# EAGLE design Encoder Adapter (EAGLE 9.6.1)
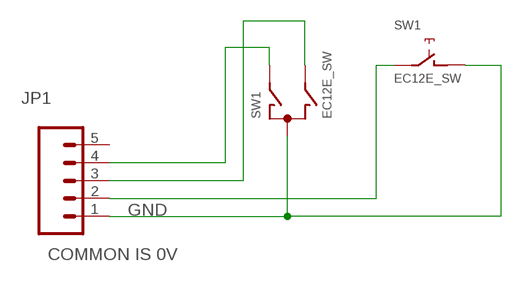
[diagram p0: schematic, sheet 1]

## Parts
JP1  M05LOCK  [1X05_LOCK]
SW1  EC12E_SW  [ALPS_EC12E_SW]

## Nets
GND: JP1.1 SW1.C SW1.D
N$3: JP1.2 SW1.E
N$4: JP1.4 SW1.A
N$5: JP1.3 SW1.B
Unconnected: JP1.5 SW1.GND1(G) SW1.GND2(G)

## Notes on the sheet
- COMMON IS 0V

## Library data of the parts
JP1 = SparkFun-Connectors:M05: Header 5 Standard 5-pin 0.1" header. Use with straight break away headers (SKU : PRT-00116), right angle break away headers (PRT-00553), swiss pins (PRT-00743), machine pins (PRT-00117), and female headers (PRT-00115). Molex polarized connector foot print use with SKU : PRT-08230 with associated crimp pins and housings.
SW1 = switch-alps:EC12E_SW: ALPS rotary Encoder EC12E series with switch; MPN: EC12E2424407; OC_FARNELL: 1520813; OC_NEWARK: 74M1068

## Board
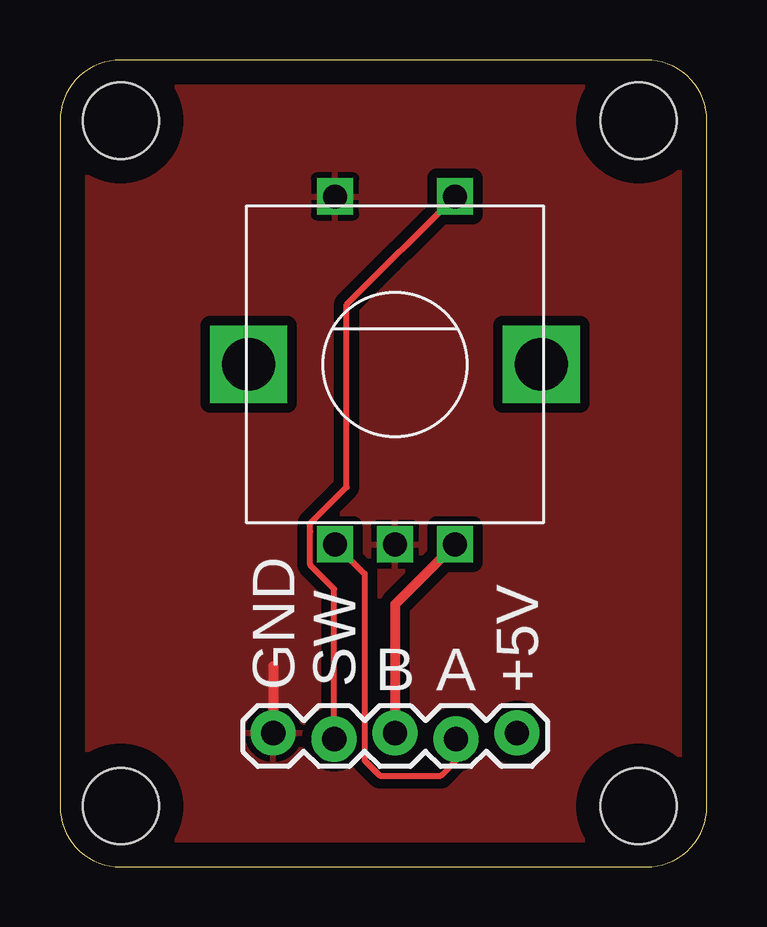
[diagram p1: board, top side]

Size 26.98 x 33.65 mm. Coordinates in mm from the lower left corner, seen from the top.
Outline: 0,31.1 0,2.54 arc90 2.54,0 24.43,0 arc90 26.98,2.54 26.98,31.1 arc90 24.43,33.65 2.54,33.65 arc90 0,31.1
Copper layers (1*16): Top 0.035mm / dielectric 1.5mm / Bottom 0.035mm
Design rules "default": minimum track width 10mil, minimum drill 0.35mm, track to track 6mil, track to pad 6mil, pad to pad 6mil, via to via 6mil, smd to smd 6mil, copper to edge 40mil, drill to drill 6mil, minimum pad ring 10mil, minimum via ring 8mil, stop-mask expansion 4mil, vias tented up to drill 0mil, thermal gap 10mil
Holes 3.17 mm at 2.54,31.12 24.13,31.12 24.13,2.54 2.54,2.54

### Footprints (pad centres in the part's own frame; a part is rotated, then mirrored left to right if it is on the bottom)
1X05_LOCK = drill 1.016 pad 1.88: 1 0,0.127; 2 2.54,-0.127; 3 5.08,0.127; 4 7.62,-0.127; 5 10.16,0.127
ALPS_EC12E_SW = drill 1 square: A -2.5,-7.5; B 2.5,-7.5; C 0,-7.5; D -2.5,7; E 2.5,7 | drill 2.2 square: GND1 -6.1,0; GND2 6.1,0

### Placement (x,y rotation side)
JP1  8.89,5.46 0 top
SW1  13.97,20.95 0 top

### Tracks (layer width: path | path; a pad name or v marks a point on that pad's centre or on a via)
GND
  Top 0.406: 8.89,8.38 JP1.1
  pour Top (isolate 0.406): 5.08,34.92 26.04,34.92 29.21,31.75 29.21,-0.63 28.57,-1.27 1.27,-1.27 -1.27,1.27 -1.27,34.29 -0.64,34.92
N$3
  Top 0.254: SW1.E 11.95,23.44 11.95,15.84 10.44,14.32 10.44,13.97 10.44,12.59 11.43,11.59 JP1.2
N$4
  Top 0.254: SW1.A 12.7,12.23 12.7,4.45 13.34,3.81 15.88,3.81 16.51,4.45 JP1.4
N$5
  Top 0.406: SW1.B 13.97,10.95 JP1.3

### Text on the board
tNames: GND | SW | +5V | B | A